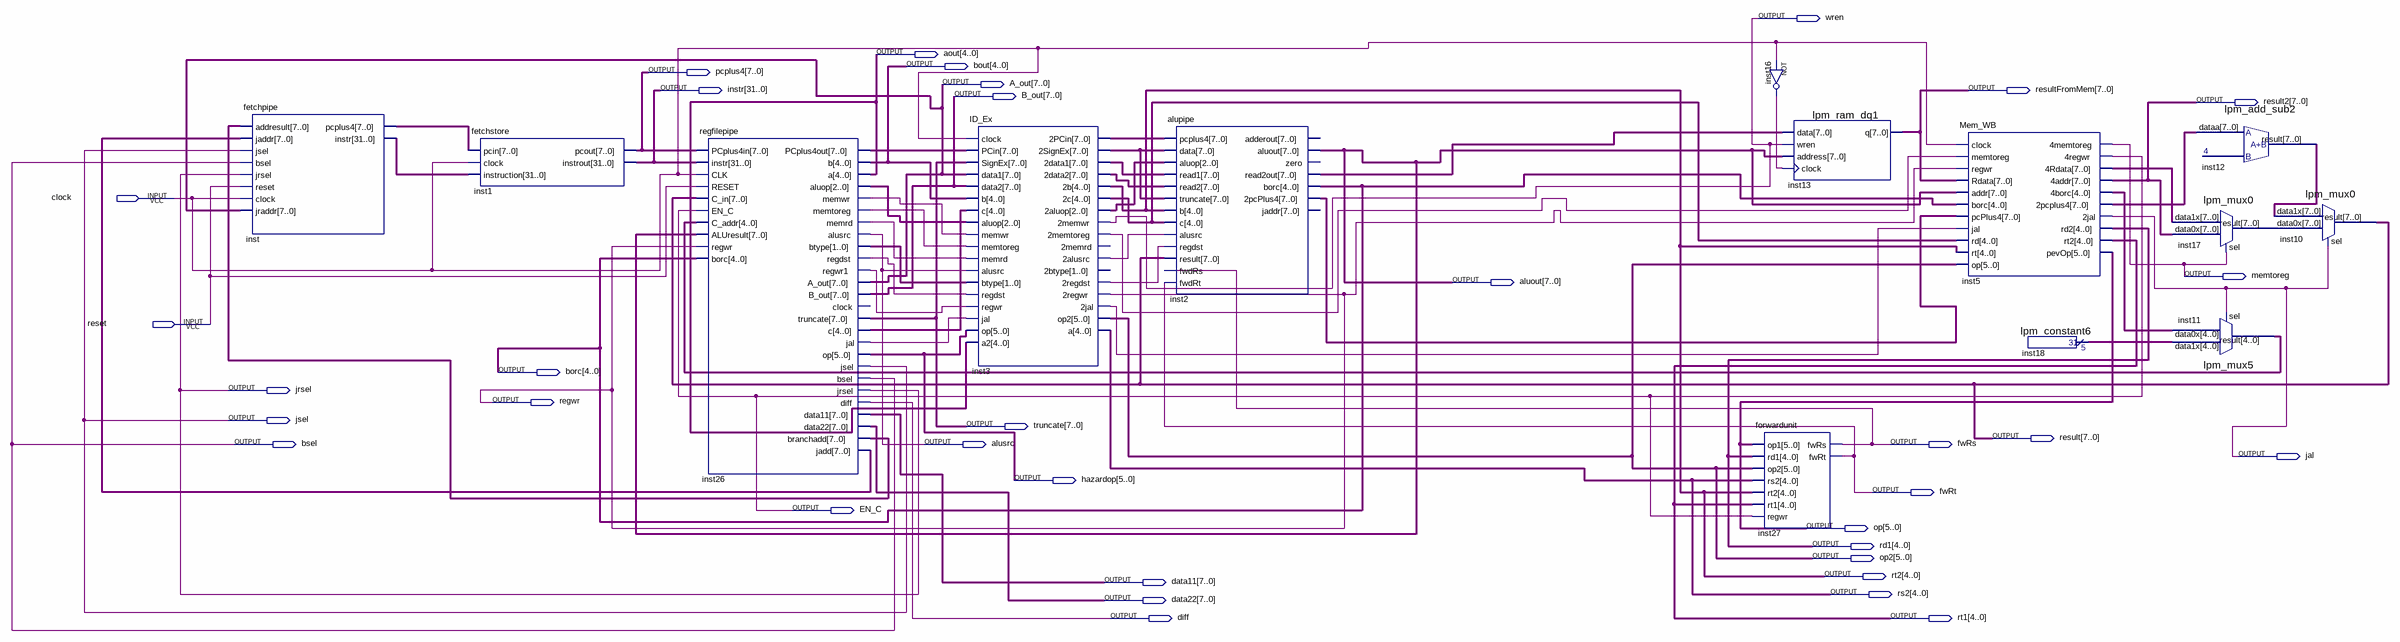
[diagram p0: schematic sheet]
// Quartus schematic proj2.bdf as structural Verilog: 14 symbols, 35 pins
module proj2 (
  input  clock,
  input  reset,
  output wren,
  output [4:0] aout,
  output [4:0] bout,
  output [7:0] pcplus4,
  output [7:0] A_out,
  output [31:0] instr,
  output [7:0] resultFromMem,
  output [7:0] B_out,
  output [7:0] result2,
  output memtoreg,
  output [7:0] aluout,
  output [4:0] borc,
  output jrsel,
  output regwr,
  output jsel,
  output [7:0] truncate,
  output [7:0] result,
  output bsel,
  output alusrc,
  output fwRs,
  output jal,
  output [5:0] hazardop,
  output fwRt,
  output EN_C,
  output [5:0] op,
  output [4:0] rd1,
  output [5:0] op2,
  output [4:0] rt2,
  output [7:0] data11,
  output [4:0] rs2,
  output [7:0] data22,
  output diff,
  output [4:0] rt1
);

  wire inst3_2alusrc, inst3_2jal, inst3_2memtoreg, inst3_2regdst, inst16_out, inst26_jal, inst26_memrd,
       inst26_memtoreg, inst26_memwr, inst26_regdst, inst26_regwr1;
  wire [1:0] inst26_btype;
  wire [2:0] inst3_2aluop, inst26_aluop;
  wire [4:0] inst3_2c, inst5_4borc, inst11_result, inst18_result, inst26_c;
  wire [7:0] inst2_2pcplus4, inst2_read2out, inst3_2data1, inst3_2data2, inst3_2pcin, inst3_2signex,
       inst5_2pcplus4, inst5_4rdata, inst12_result, inst17_result, inst26_branchadd, inst26_jadd,
       inst26_pcplus4out, inst_pcplus4;
  wire [31:0] inst_instr;

  fetchpipe inst (
    .addresult(inst26_branchadd), .jaddr(inst26_jadd), .jsel(jsel), .bsel(bsel), .jrsel(jrsel),
    .reset(reset), .clock(clock), .jraddr(A_out), .pcplus4(inst_pcplus4), .instr(inst_instr));
  fetchstore inst1 (.pcin(inst_pcplus4), .clock(clock), .instruction(inst_instr), .pcout(pcplus4), .instrout(instr));
  regfilepipe inst26 (
    .PCplus4in(pcplus4), .instr(instr), .CLK(clock), .RESET(reset), .C_in(result), .EN_C(EN_C),
    .C_addr(inst11_result), .ALUresult(aluout), .regwr(regwr), .borc(borc), .PCplus4out(inst26_pcplus4out),
    .b(bout), .a(aout), .aluop(inst26_aluop), .memwr(inst26_memwr), .memtoreg(inst26_memtoreg),
    .memrd(inst26_memrd), .alusrc(alusrc), .btype(inst26_btype), .regdst(inst26_regdst),
    .regwr1(inst26_regwr1), .A_out(A_out), .B_out(B_out), .truncate(truncate), .c(inst26_c),
    .jal(inst26_jal), .op(hazardop), .jsel(jsel), .bsel(bsel), .jrsel(jrsel), .diff(diff), .data11(data11),
    .data22(data22), .branchadd(inst26_branchadd), .jadd(inst26_jadd));  // open: clock
  ID_Ex inst3 (
    .clock(clock), .PCin(inst26_pcplus4out), .SignEx(truncate), .data1(A_out), .data2(B_out), .b(bout),
    .c(inst26_c), .aluop(inst26_aluop), .memwr(inst26_memwr), .memtoreg(inst26_memtoreg),
    .memrd(inst26_memrd), .alusrc(alusrc), .btype(inst26_btype), .regdst(inst26_regdst),
    .regwr(inst26_regwr1), .jal(inst26_jal), .op(hazardop), .a2(aout), .\2PCin (inst3_2pcin),
    .\2SignEx (inst3_2signex), .\2data1 (inst3_2data1), .\2data2 (inst3_2data2), .\2b (rt2), .\2c (inst3_2c),
    .\2aluop (inst3_2aluop), .\2memwr (wren), .\2memtoreg (inst3_2memtoreg), .\2alusrc (inst3_2alusrc),
    .\2regdst (inst3_2regdst), .\2regwr (regwr), .\2jal (inst3_2jal), .op2(op2), .a(rs2));  // open: 2memrd, 2btype
  alupipe inst2 (
    .pcplus4(inst3_2pcin), .data(inst3_2signex), .aluop(inst3_2aluop), .read1(inst3_2data1),
    .read2(inst3_2data2), .truncate(inst3_2signex), .b(rt2), .c(inst3_2c), .alusrc(inst3_2alusrc),
    .regdst(inst3_2regdst), .result(result), .fwdRs(fwRs), .fwdRt(fwRt), .aluout(aluout),
    .read2out(inst2_read2out), .borc(borc), .\2pcPlus4 (inst2_2pcplus4));  // open: adderout, zero, jaddr
  not inst16 (inst16_out, clock);
  forwardunit inst27 (
    .op1(op), .rd1(rd1), .op2(op2), .rs2(rs2), .rt2(rt2), .rt1(rt1), .regwr(EN_C), .fwRs(fwRs), .fwRt(fwRt));
  lpm_ram_dq1 inst13 (.data(inst2_read2out), .wren(wren), .address(aluout), .clock(inst16_out), .q(resultFromMem));
  Mem_WB inst5 (
    .clock(clock), .memtoreg(inst3_2memtoreg), .regwr(regwr), .Rdata(resultFromMem), .addr(aluout),
    .borc(borc), .pcPlus4(inst2_2pcplus4), .jal(inst3_2jal), .rd(inst3_2c), .rt(rt2), .op(op2),
    .\4memtoreg (memtoreg), .\4regwr (EN_C), .\4Rdata (inst5_4rdata), .\4addr (result2),
    .\4borc (inst5_4borc), .\2pcplus4 (inst5_2pcplus4), .\2jal (jal), .rd2(rd1), .rt2(rt1), .pevOp(op));
  lpm_constant6 inst18 (.result(inst18_result));
  lpm_add_sub2 inst12 (.dataa(inst5_2pcplus4), .result(inst12_result));
  lpm_mux0 inst17 (.data1x(inst5_4rdata), .data0x(result2), .sel(memtoreg), .result(inst17_result));
  lpm_mux5 inst11 (.data1x(inst18_result), .data0x(inst5_4borc), .sel(jal), .result(inst11_result));
  lpm_mux0 inst10 (.data1x(inst12_result), .data0x(inst17_result), .sel(jal), .result(result));
endmodule
